# Altium schematic sheet reset.SchDoc
size A4
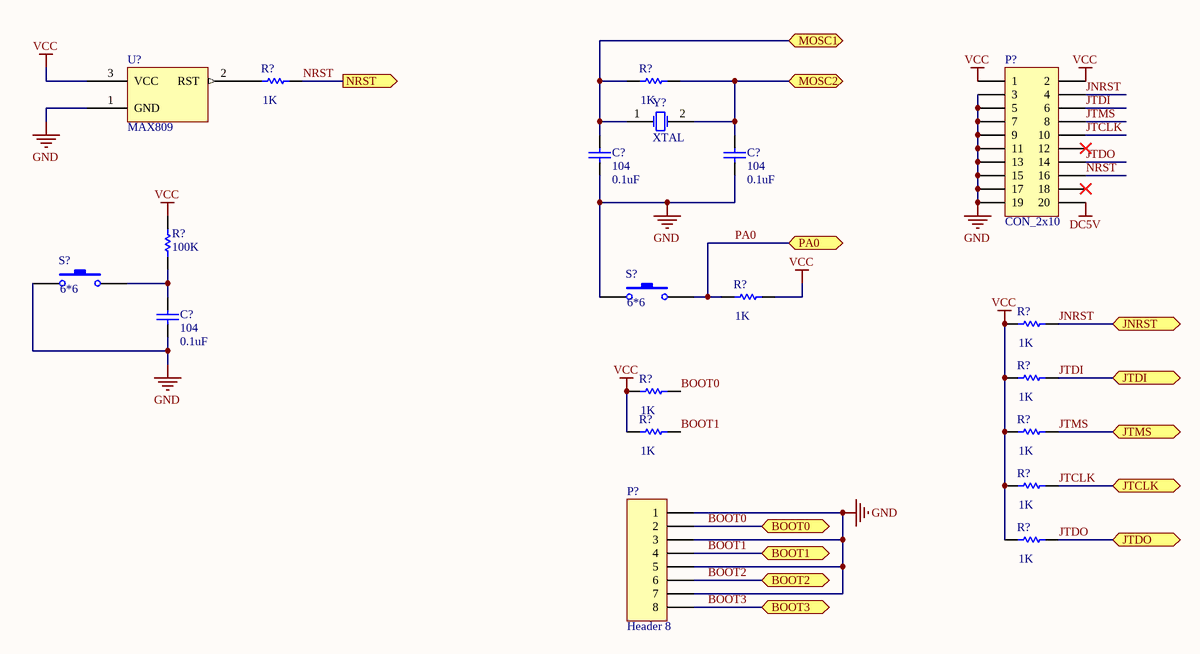
[diagram p0: reset.SchDoc]

## Parts
(Parts that share a designator on the sheet are numbered #1, #2 ... from top to bottom, then left to right.)
C?#1  104  value 0.1uF  [RAD-0.3]
C?#2  104  value 0.1uF  [RAD-0.3]
C?#3  104  value 0.1uF  [RAD-0.3]
P?#1  CON_2x10  [HDR2X10]
P?#2  Header 8  [HDR1X8]
R?#1  value 1K  [AXIAL-0.3]  (hidden comment: Res1)
R?#2  value 1K  [AXIAL-0.3]  (hidden comment: Res1)
R?#3  value 100K  [AXIAL-0.3]  (hidden comment: Res1)
R?#4  value 1K  [AXIAL-0.3]  (hidden comment: Res1)
R?#5  value 1K  [AXIAL-0.3]  (hidden comment: Res1)
R?#6  value 1K  [AXIAL-0.3]  (hidden comment: Res1)
R?#7  value 1K  [AXIAL-0.3]  (hidden comment: Res1)
R?#8  value 1K  [AXIAL-0.3]  (hidden comment: Res1)
R?#9  value 1K  [AXIAL-0.3]  (hidden comment: Res1)
R?#10  value 1K  [AXIAL-0.3]  (hidden comment: Res1)
R?#11  value 1K  [AXIAL-0.3]  (hidden comment: Res1)
S?#1  6*6  [SPST-2]
S?#2  6*6  [SPST-2]
U?  MAX809  [SOT-23]
Y?  XTAL  [R38]

## Ports
BOOT0 (bidir), BOOT1 (bidir), BOOT2 (bidir), BOOT3 (bidir), JNRST (bidir), JTCLK (bidir), JTDI (bidir), JTDO (bidir), JTMS (bidir), MOSC1 (bidir), MOSC2 (bidir), NRST (out), PA0 (bidir)

## Nets
DC5V: P?#1.20
GND: C?#1.1 C?#2.1 C?#3.1 P?#1.3 P?#1.5 P?#1.7 P?#1.9 P?#1.11 P?#1.13 P?#1.15 P?#1.17 P?#1.19 P?#2.1 P?#2.3 P?#2.5 P?#2.7 S?#1.1 S?#2.1 U?.1(GND)
VCC: P?#1.1 P?#1.2 R?#3.2 R?#4.2 R?#5.1 R?#6.1 R?#7.1 R?#8.1 R?#9.1 R?#10.1 R?#11.1 U?.3(VCC)
BOOT0: P?#2.2 R?#7.2 ; port BOOT0
BOOT1: P?#2.4 R?#8.2 ; port BOOT1
BOOT2: P?#2.6 ; port BOOT2
BOOT3: P?#2.8 ; port BOOT3
JNRST: P?#1.4 R?#5.2 ; port JNRST
JTCLK: P?#1.10 R?#10.2 ; port JTCLK
JTDI: P?#1.6 R?#6.2 ; port JTDI
JTDO: P?#1.14 R?#11.2 ; port JTDO
JTMS: P?#1.8 R?#9.2 ; port JTMS
MOSC1: C?#1.2 R?#2.1 Y?.1(OSC1) ; port MOSC1
MOSC2: C?#2.2 R?#2.2 Y?.2(OSC2) ; port MOSC2
NRST: P?#1.16 R?#1.2 ; port NRST
PA0: R?#4.1 S?#2.2 ; port PA0
NetC?#3_2: C?#3.2 R?#3.1 S?#1.2
NetR?#1_1: R?#1.1 U?.2(RST)

Not connected (* = marked no-connect by the designer): P?#1 12* 18*

## Library data of the parts
C?#1-C?#3 = Cap: Capacitor; Published: 8-Jun-2000; LatestRevisionDate: 17-Jul-2002; LatestRevisionNote: Re-released for DXP Platform.; PackageReference: RAD-0.3; Publisher: Altium Limited; PackageDescription: Radial Cap, Thru-Hole; 2 Leads; 0.3 in Pin Spacing
P?#1 = Header 10X2: Header, 10-Pin, Dual row; LatestRevisionDate: 17-Jul-2002; LatestRevisionNote: Re-released for DXP Platform.; Publisher: Altium Limited
P?#2 = Header 8: Header, 8-Pin; LatestRevisionDate: 17-Jul-2002; LatestRevisionNote: Re-released for DXP Platform.; Publisher: Altium Limited
R?#1-R?#11 = Res1: Resistor; Published: 8-Jun-2000; LatestRevisionDate: 17-Jul-2002; LatestRevisionNote: Re-released for DXP Platform.; PackageReference: AXIAL-0.3; Publisher: Altium Limited; PackageDescription: Axial Device, Thru-Hole; 2 Leads; 0.3 in Pin Spacing
S?#1 S?#2 = SW-PB: Switch; Published: 24-Mar-1999; LatestRevisionDate: 17-Jul-2002; LatestRevisionNote: Re-released for DXP Platform.; PackageReference: SPST-2; Publisher: Altium Limited; PackageDescription: Switch; 2 Leads
Y? = XTAL: Crystal Oscillator; Published: 8-Jun-2000; LatestRevisionDate: 17-Jul-2002; LatestRevisionNote: Re-released for DXP Platform.; PackageReference: R38; Publisher: Altium Limited; PackageDescription: Crystal, Thru-Hole; 2 Leads; Body 3.1 x 8.2 mm (Dia.xH)